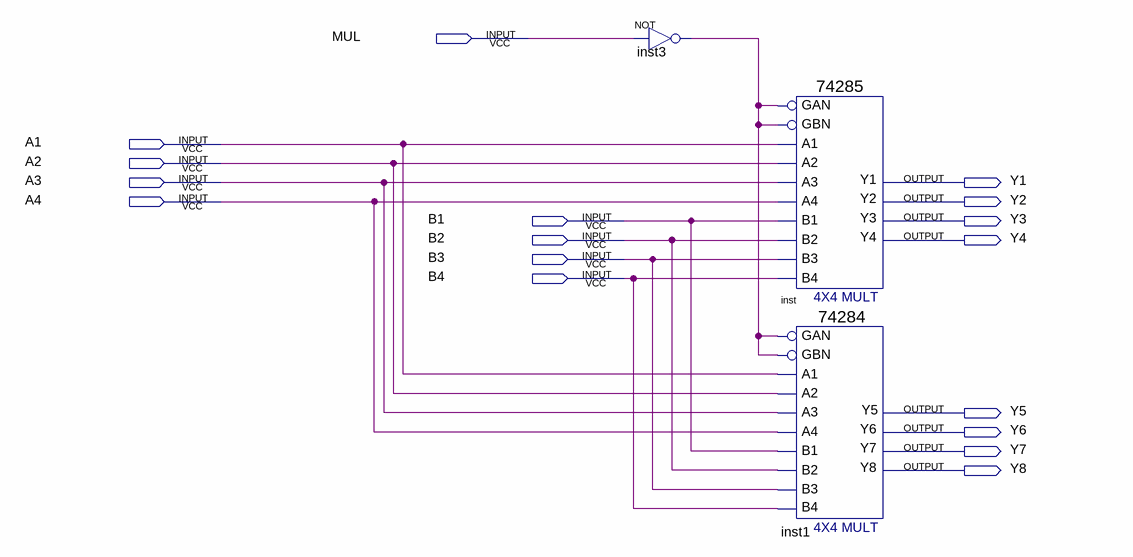
[diagram p0: schematic sheet]
// Quartus schematic mul.bdf as structural Verilog: 3 symbols, 17 pins
module mul (
  input  MUL,
  input  A1,
  input  A2,
  input  A3,
  input  A4,
  input  B1,
  input  B2,
  input  B3,
  input  B4,
  output Y1,
  output Y2,
  output Y3,
  output Y4,
  output Y5,
  output Y6,
  output Y7,
  output Y8
);

  wire inst3_out;

  not inst3 (inst3_out, MUL);
  \74285  inst (
    .GBN(inst3_out), .GAN(inst3_out), .A1(A1), .A2(A2), .A3(A3), .B2(B2), .B1(B1), .A4(A4), .B4(B4), .B3(B3),
    .Y4(Y4), .Y1(Y1), .Y2(Y2), .Y3(Y3));
  \74284  inst1 (
    .GAN(inst3_out), .A2(A2), .A1(A1), .GBN(inst3_out), .B1(B1), .A4(A4), .A3(A3), .B4(B4), .B3(B3), .B2(B2),
    .Y8(Y8), .Y6(Y6), .Y7(Y7), .Y5(Y5));
endmodule
